# EAGLE design MSOP-16 Breakout Board (EAGLE 9.5.0)
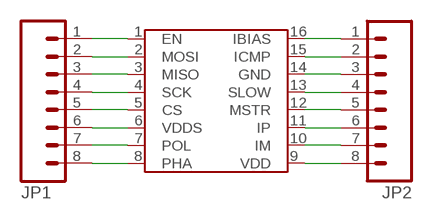
[diagram p0: schematic, sheet 1]

## Parts
JP1  M08  [1X08]
JP2  M08  [1X08]
U$1  LTC6820  [MSOP-16]

## Nets
N$1: JP1.8 U$1.8(PHA)
N$2: JP1.6 U$1.6(VDDS)
N$3: JP1.5 U$1.5(CS)
N$4: JP1.4 U$1.4(SCK)
N$5: JP1.3 U$1.3(MISO)
N$6: JP1.1 U$1.1(EN)
N$8: JP1.2 JP1.7 U$1.2(MOSI) U$1.7(POL)
N$11: JP2.8 U$1.9(VDD)
N$12: JP2.7 U$1.10(IM)
N$13: JP2.6 U$1.11(IP)
N$14: JP2.5 U$1.12(MSTR)
N$15: JP2.4 U$1.13(SLOW)
N$16: JP2.3 U$1.14(GND)
N$17: JP2.2 U$1.15(ICMP)
N$18: JP2.1 U$1.16(IBIAS)

## Library data of the parts
JP1 JP2 = HyTechDevices:M08: Standard 8-pin 0.1" header. NOTES ON THE VARIANTS LOCK and LOCK_LONGPADS... This footprint was designed to help hold the alignment of a through-hole component (i.e. 6-pin header) while soldering it into place. You may notice that each hole has been shifted either up or down by 0.005 of an inch from it's more standard position (which is a perfectly straight line). This slight alteration caused the pins (the squares in the middle) to touch the edges of the holes. Because they are alternating, it causes a "brace" to hold the component in place. 0.005 has proven to be the perfect amount of "off-center" position when using our standard breakaway headers. Although looks a little odd when you look at the bare footprint, once you have a header in there, the alteration is very hard to notice. Also,if you push a header all the way into place, it is covered up entirely on the bottom side. This idea of altering the position of holes to aid alignment will be further integrated into the Sparkfun Library for other footprints. It can help hold any component with 3 or more connection pins. Note: The Sparkfun version includes many other packages including surface mount that may be of future interest. Source: Sparkfun <https://github.com/sparkfun/SparkFun-Eagle-Libraries>
U$1 = HyTechDevices:LTC6820: Linear Technology isoSPI Isolated Communications Interface Datasheet <http://cds.linear.com/docs/en/datasheet/6820fb.pdf>

## Net classes
0 default: width 0.305 mm, clearance 0.152 mm

## Board
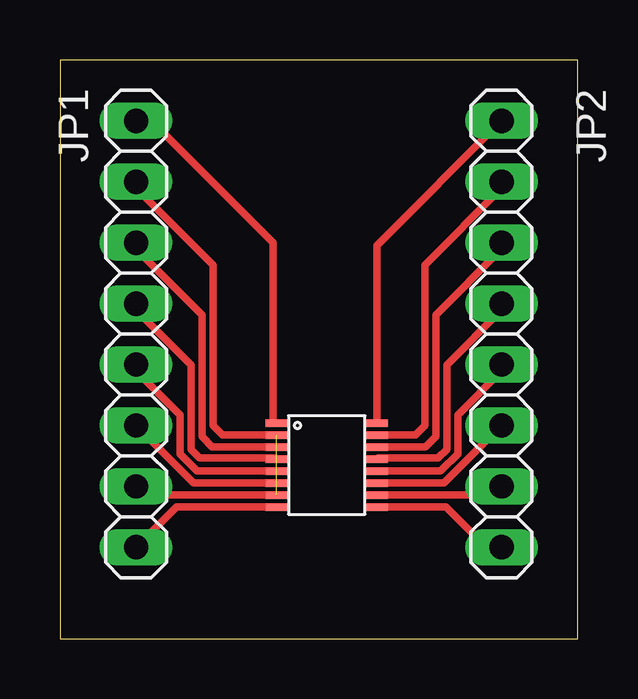
[diagram p1: board, top side]

Size 21.59 x 24.13 mm. Coordinates in mm from the lower left corner, seen from the top.
Outline: 0,0 21.59,0 21.59,24.13 0,24.13 0,0
Copper layers (1*16): Top 0.035mm / dielectric 1.5mm / Bottom 0.035mm
Design rules "DRC Advanced Circuits": minimum track width 6mil, minimum drill 15mil, track to track 6mil, track to pad 6mil, pad to pad 6mil, via to via 6mil, smd to smd 6mil, copper to edge 40mil, drill to drill 6mil, minimum pad ring 10mil, minimum via ring 8mil, stop-mask expansion 4mil, vias tented up to drill 0mil, thermal gap 10mil

### Footprints (pad centres in the part's own frame; a part is rotated, then mirrored left to right if it is on the bottom)
1X08 = drill 1.016 long: 1 -8.89,0; 2 -6.35,0; 3 -3.81,0; 4 -1.27,0; 5 1.27,0; 6 3.81,0; 7 6.35,0; 8 8.89,0
MSOP-16 = smd 0.305 x 0.889: 1 -0.1,-0.5; 2 0.4,-0.5; 3 0.9,-0.5; 4 1.4,-0.5; 5 1.9,-0.5; 6 2.4,-0.5; 7 2.9,-0.5; 8 3.4,-0.5; 9 3.4,3.7; 10 2.9,3.7; 11 2.4,3.7; 12 1.9,3.7; 13 1.4,3.7; 14 0.9,3.7; 15 0.4,3.7; 16 -0.1,3.7

### Placement (x,y rotation side)
JP1  3.17,12.7 270 top
JP2  18.41,12.7 270 top
U$1  9.53,8.89 270 top

### Tracks (layer width: path | path; a pad name or v marks a point on that pad's centre or on a via)
N$1
  Top 0.305: JP1.8 4.86,5.49 U$1.8
N$2
  Top 0.305: U$1.6 5.58,6.49 JP1.6
N$3
  Top 0.305: U$1.5 5.72,6.99 5,7.71 5,9.33 3.17,11.16 JP1.5
N$4
  Top 0.305: U$1.4 8.98,7.53 5.83,7.53 5.46,7.9 5.46,11.42 3.17,13.7 JP1.4
N$5
  Top 0.305: U$1.3 6.72,7.99 | 6.72,7.99 | 6.72,7.99 6.35,7.99 5.92,8.42 5.92,13.5 3.17,16.24 JP1.3
N$6
  Top 0.305: U$1.1 8.89,9.13 8.89,16.51 3.81,21.59 JP1.1
N$8  (1 unrouted)
  Top 0.305: U$1.7 3.54,5.99 JP1.7 | U$1.2 6.78,8.49 6.38,8.89 6.38,15.58 3.17,18.78 JP1.2
N$11
  Top 0.305: JP2.8 17.78,3.81 16.1,5.49 U$1.9
N$12
  Top 0.305: JP2.7 18.05,5.99 U$1.10
N$13
  Top 0.305: U$1.11 16.02,6.49 JP2.6
N$14
  Top 0.305: U$1.12 15.87,6.99 16.59,7.71 16.59,9.33 18.41,11.16 JP2.5
N$15
  Top 0.305: U$1.13 13.27,7.53 15.77,7.53 16.13,7.9 16.13,11.42 18.41,13.7 JP2.4
N$16
  Top 0.305: U$1.14 14.87,7.99 | 14.87,7.99 | 14.87,7.99 15.24,7.99 15.67,8.42 15.67,13.5 18.41,16.24 JP2.3
N$17
  Top 0.305: U$1.15 14.81,8.49 15.21,8.89 15.21,15.58 18.41,18.78 JP2.2
N$18
  Top 0.305: U$1.16 13.22,16.4 JP2.1

### Text on the board
tDocu: HyTech Racing | MSOP-16 | Breakout